# Altium schematic sheet AFFICHEUR.SchDoc: DISPLAY
size A4; Date: 16 02 2016; Author: Rachid AKKOUCHE; DrawnBy: Rachid AKKOUCHE; Engineer: Rachid AKKOUCHE; DocumentNumber: BRA201909267; Revision: II; SheetNumber: 2; SheetTotal: 3; Dessinepar: Rachid AKKOUCHE; Property: Rachid AKKOUCHE; Time: 08:00
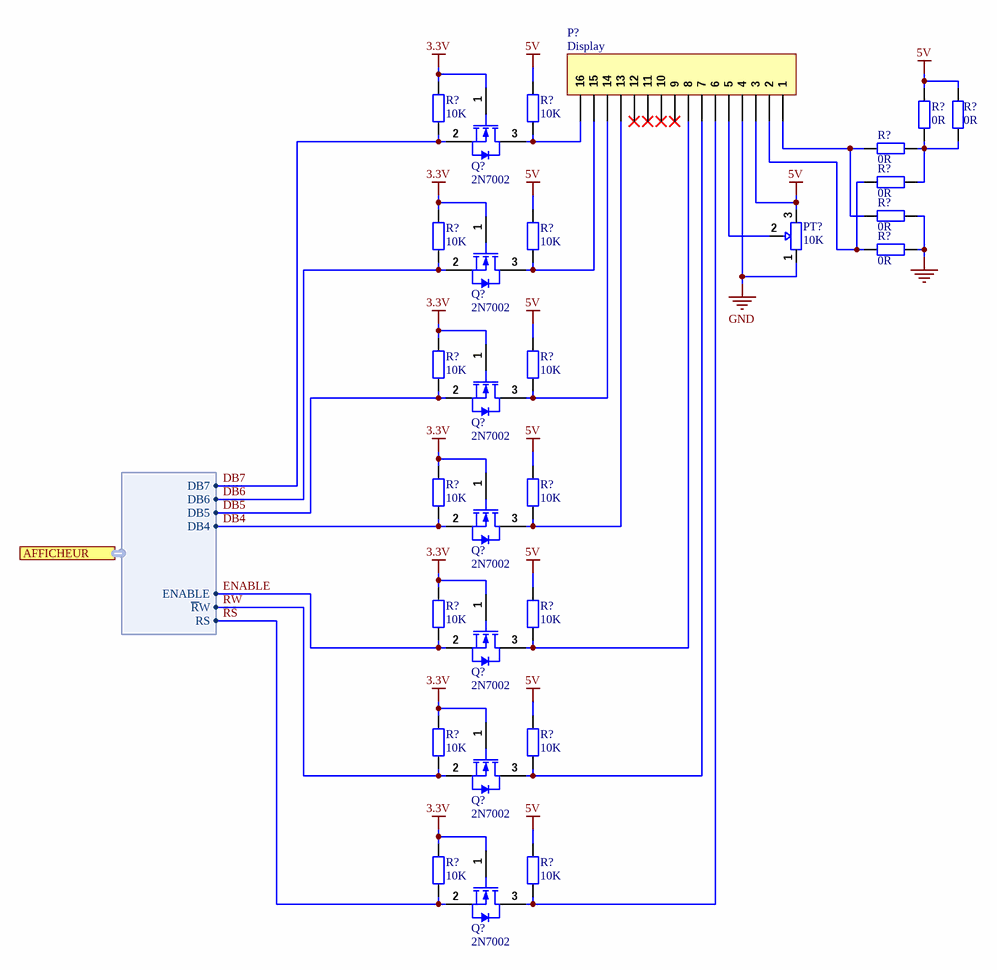
[diagram p0: AFFICHEUR.SchDoc]

## Parts
(Parts that share a designator on the sheet are numbered #1, #2 ... from top to bottom, then left to right.)
P?  Display  [MOLEX 22112162]
PT?  10K  [3361P]
Q?#1  2N7002  [SOT23]
Q?#2  2N7002  [SOT23]
Q?#3  2N7002  [SOT23]
Q?#4  2N7002  [SOT23]
Q?#5  2N7002  [SOT23]
Q?#6  2N7002  [SOT23]
Q?#7  2N7002  [SOT23]
R?#1  0R  [R 0805(2012)]
R?#2  0R  [R 0805(2012)]
R?#3  10K  [R 0805(2012)]
R?#4  10K  [R 0805(2012)]
R?#5  0R  [R 0805(2012)]
R?#6  0R  [R 0805(2012)]  (no BOM)
R?#7  0R  [R 0805(2012)]  (no BOM)
R?#8  10K  [R 0805(2012)]
R?#9  10K  [R 0805(2012)]
R?#10  0R  [R 0805(2012)]
R?#11  10K  [R 0805(2012)]
R?#12  10K  [R 0805(2012)]
R?#13  10K  [R 0805(2012)]
R?#14  10K  [R 0805(2012)]
R?#15  10K  [R 0805(2012)]
R?#16  10K  [R 0805(2012)]
R?#17  10K  [R 0805(2012)]
R?#18  10K  [R 0805(2012)]
R?#19  10K  [R 0805(2012)]
R?#20  10K  [R 0805(2012)]

## Ports
AFFICHEUR (harness Display)

## Harnesses
Display: RS, ~{R}W, ENABLE, DB4, DB5, DB6, DB7

## Nets
3.3V: Q?#1.1(G) Q?#2.1(G) Q?#3.1(G) Q?#4.1(G) Q?#5.1(G) Q?#6.1(G) Q?#7.1(G) R?#3.2 R?#8.2 R?#11.2 R?#13.2 R?#15.2 R?#17.2 R?#19.2
5V: P?.3 PT?.3 R?#1.1 R?#2.1 R?#4.2 R?#9.2 R?#12.2 R?#14.2 R?#16.2 R?#18.2 R?#20.2
GND: P?.4 PT?.1 R?#7.1 R?#10.1
DB4: Q?#4.2(S) R?#13.1 ; port AFFICHEUR.DB4
DB5: Q?#3.2(S) R?#11.1 ; port AFFICHEUR.DB5
DB6: Q?#2.2(S) R?#8.1 ; port AFFICHEUR.DB6
DB7: Q?#1.2(S) R?#3.1 ; port AFFICHEUR.DB7
ENABLE: Q?#5.2(S) R?#15.1 ; port AFFICHEUR.ENABLE
~{R}W: Q?#6.2(S) R?#17.1 ; port AFFICHEUR.~{R}W
RS: Q?#7.2(S) R?#19.1 ; port AFFICHEUR.RS
NetP?_1: P?.1 R?#5.2 R?#7.2
NetP?_2: P?.2 R?#6.2 R?#10.2
NetP?_5: P?.5 PT?.2
NetP?_6: P?.6 Q?#7.3(D) R?#20.1
NetP?_7: P?.7 Q?#6.3(D) R?#18.1
NetP?_8: P?.8 Q?#5.3(D) R?#16.1
NetP?_13: P?.13 Q?#4.3(D) R?#14.1
NetP?_14: P?.14 Q?#3.3(D) R?#12.1
NetP?_15: P?.15 Q?#2.3(D) R?#9.1
NetP?_16: P?.16 Q?#1.3(D) R?#4.1
NetR?#1_2: R?#1.2 R?#2.2 R?#5.1 R?#6.1

Not connected (* = marked no-connect by the designer): P? 9* 10* 11* 12*

## Notes on the sheet
- Ce document est la propriété de
- Project:
- Il ne peut être divulgué sans l'accord écrit de l'un de ses représentants dûment mandaté
- Title:
- Number:
- Date:
- Time:
- Size:
- A4
- Revision:
- Sheet
- of
- 2, rue Georges MELIES
- Draw by:
- 78390 BOIS D'ARCY

## Library data of the parts
P? = Header 16: Header, 16-Pin; LatestRevisionDate: 17-Jul-2002; LatestRevisionNote: Re-released for DXP Platform.; Publisher: Altium Limited
PT? = RV: Manufacturer: BOURNS; Manufacturer Part Number: 3361P-1-103GLF; Supplier 1: Farnell; Supplier Part Number 1: 1696060; RoHS: YES; Pricing 1: 5=0,83, 50=0,77, 100=0,69, 250=0,65, 750=0,6 (EUR); ComponentLink1URL: http://www.farnell.com/datasheets/1563530.igs; ComponentLink1Description: http://www.farnell.com/datasheets/1563530.igs; ComponentLink2URL: http://www.farnell.com/datasheets/1733537.pdf; ComponentLink2Description: http://www.farnell.com/datasheets/1733537.pdf; ComponentLink3URL: http://www.farnell.com/cad/1563578.stp; ComponentLink3Description: http://www.farnell.com/cad/1563578.stp
Q?#1-Q?#7 = 2N7002: N-channel Enhancement Mode Field-effect Transistor; Continuous Drain Current (ID): 115mA; Drain to Source Breakdown Voltage: 60V; Drain to Source Resistance: 7.5R; Element Configuration: Single; Gate to Source Voltage (Vgs): 20V; Input Capacitance: 50pF; Max Power Dissipation: 225mW; Nominal Vgs: 2.5V; Number of Channels: 1; Power Dissipation: 300mW; Turn-Off Delay Time: 40ns; Turn-On Delay Time: 20ns; ComponentLink1URL: http://www.farnell.com/datasheets/660093.pdf; ComponentLink1Description: http://www.farnell.com/datasheets/660093.pdf; ComponentLink2URL: http://www.farnell.com/datasheets/410597.pdf; ComponentLink2Description: http://www.farnell.com/datasheets/410597.pdf; Case/Package: SOT-23-3; Contact Plating: Tin; Current Rating: 115mA; Drain to Source Voltage (Vdss): 60V; Halogen Free: Halogen Free; Height: 1.01mm; Lead Free: Lead Free; Length: 3.04mm; Max Operating Temperature: 150°C; Min Operating Temperature: -55°C; Number of Elements: 1; Number of Pins: 3; On-State Resistance: 7.5R; Package Quantity: 1; Packaging: Tape and Reel; Radiation Hardening: No; Rds On Max: 7.5R; REACH SVHC: No SVHC; Threshold Voltage: 2.5V; Voltage Rating (DC): 60V; Width: 1.4mm; Supplier 1: TME; Supplier Part Number 1: 2N7002LT1G
R?#1 R?#2 R?#5-R?#7 R?#10 = Resistor 0805 0R: Resistor or Jumper; Manufacturer: MULTICOMP; Manufacturer Part Number: MCMR08X000 PTL; Product Range: MULTICOMP - MCMR Series; Résistance: 0; Puissance: 125; Tolérance de résistance: ± 0.05; Type de boîtier de résistance: 0805; Type de résistance: Céramique; Coefficient de température: -200ppm/°C à +400; Tension: 150; Type de packaging: Cut Tape; Resistor Mounting: CMS; Supplier 1: Farnell; Supplier Part Number 1: 2073603; RoHS: YES; Pricing 1: 100=0,011, 500=0,009, 1000=0,008 (EUR); MSL: MSL 1 - Illimité; ComponentLink1URL: http://www.farnell.com/datasheets/1716708.pdf; ComponentLink1Description: http://www.farnell.com/datasheets/1716708.pdf
R?#3 R?#4 R?#8 R?#9 R?#11-R?#20 = Resistor 0805 10K: Resistor SMD 0805 10K; Manufacturer: MULTICOMP; Manufacturer Part Number: MC0.1W08051%10KFR; Product Range: MULTICOMP - MC Series; Résistance: 10; Puissance: 100; Tolérance de résistance: ± 1%; Type de boîtier de résistance: 0805; Type de résistance: Couche épaisse; Coefficient de température: ± 100; Tension: 150; Type de packaging: Full Reel; Resistor Mounting: CMS; Supplier 1: Farnell; RoHS: YES; Pricing 1: 5000=0,001 (EUR); MSL: MSL 1 - Illimité; ComponentLink1URL: http://www.farnell.com/datasheets/1716700.pdf; ComponentLink1Description: http://www.farnell.com/datasheets/1716700.pdf; Supplier Part Number 1: 2129195